# Altium schematic sheet Sheet_1.schdoc
size 298 x 209 mm
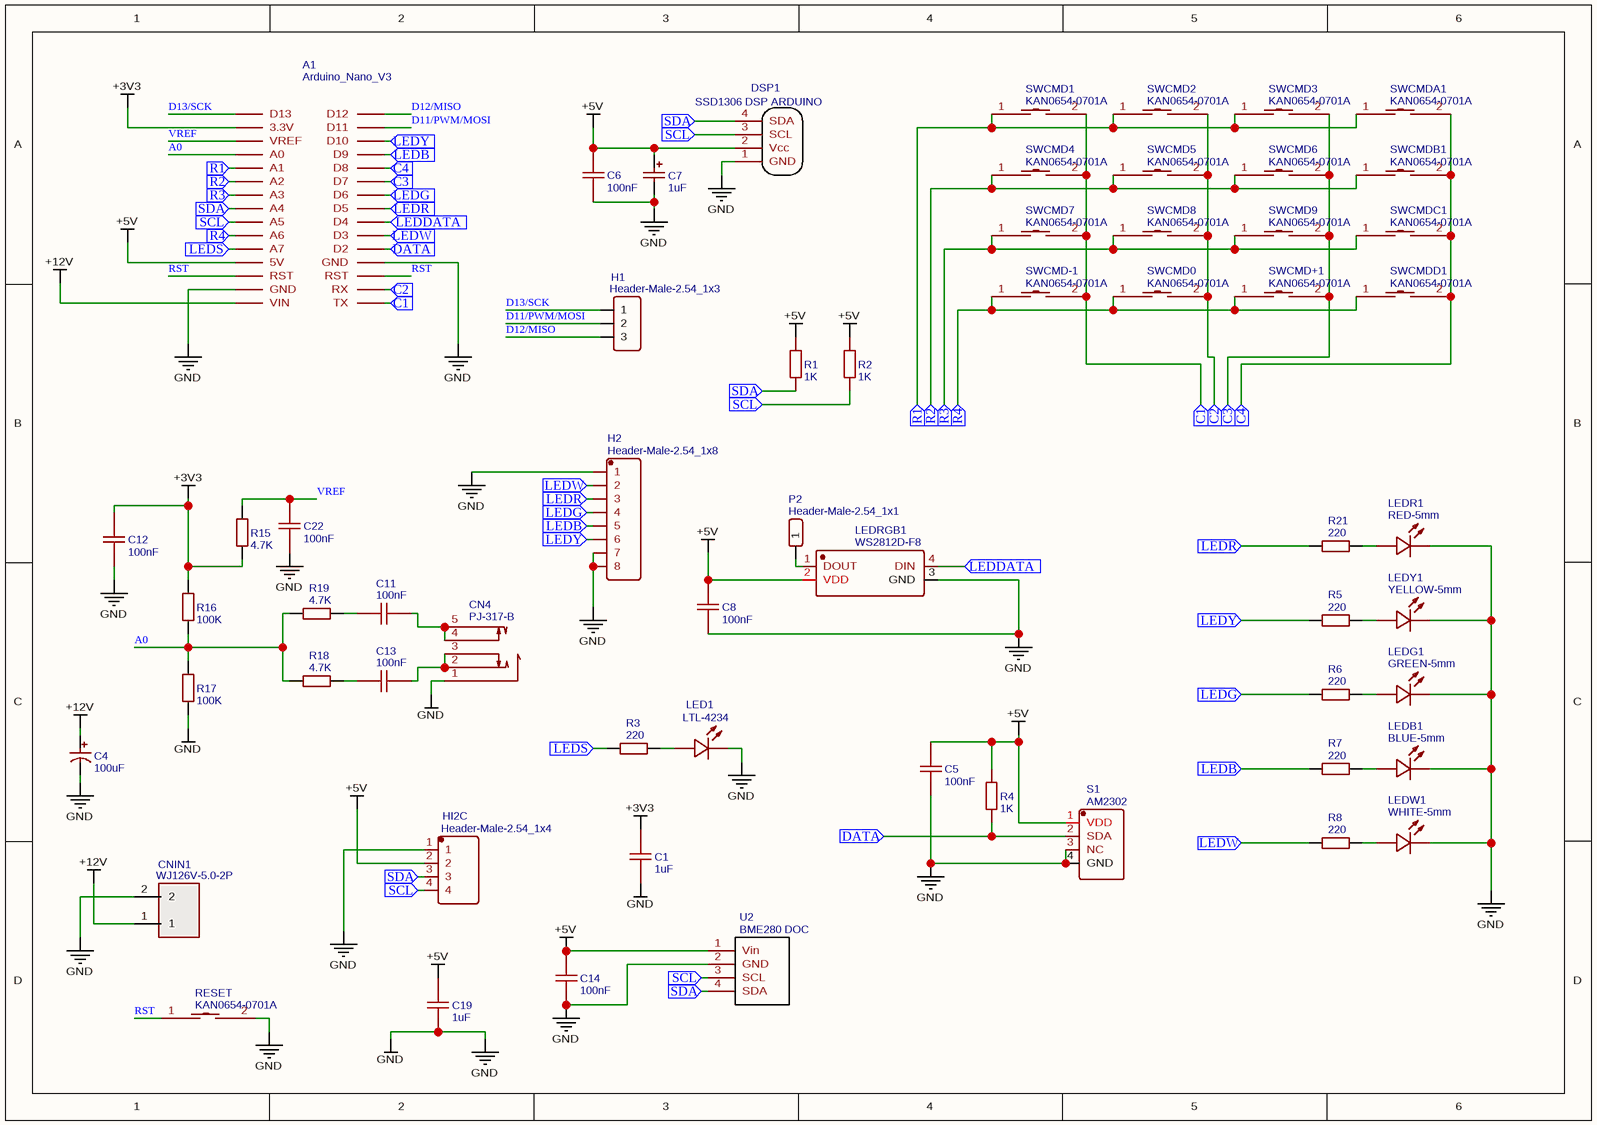
[diagram p0: Sheet_1.schdoc]

## Parts
A1  Arduino_Nano_V3  [ARDUINO_NANO_V3]
C1  1uF  [CAP-CT4-0805-4.2X3.8]
C4  100uF  [CAP-TH_BD6.3-P2.50-D1.0-FD]
C5  100nF  [CAP-CT4-0805-4.2X3.8]
C6  100nF  [CAP-CT4-0805-4.2X3.8]
C7  1uF  [CAP-TAN-S2.5]
C8  100nF  [CAP-CT4-0805-4.2X3.8]
C11  100nF  [CAP-TH_L4.8-W3.2-P5.08-D1.2]
C12  100nF  [CAP-CT4-0805-4.2X3.8]
C13  100nF  [CAP-TH_L4.8-W3.2-P5.08-D1.2]
C14  100nF  [CAP-CT4-0805-4.2X3.8]
C19  1uF  [CAP-CT4-0805-4.2X3.8]
C22  100nF  [CAP-CT4-0805-4.2X3.8]
CN4  PJ-317-B  [AUDIO-SMD_3PIN_PJ-317-B]
CNIN1  WJ126V-5.0-2P  [WJ126V-5.0-2P]
DSP1  SSD1306 DSP ARDUINO  [SSD1306_ARDUINO]
H1  Header-Male-2.54_1x3  [HDR-TH_3P-P2.54-V]
H2  Header-Male-2.54_1x8  [210S-1X8P]
HI2C  Header-Male-2.54_1x4  [DIP-1X4P-2.54MM-M]
LED1  LTL-4234  [LED-TH_BD5.0-P2.54-FD]
LEDB1  BLUE-5mm  [LED-5MM]
LEDG1  GREEN-5mm  [LED-5MM]
LEDR1  RED-5mm  [LED-5MM]
LEDRGB1  WS2812D-F8  [LED-8.0-RGB4P]
LEDW1  WHITE-5mm  [LED-5MM]
LEDY1  YELLOW-5mm  [LED-5MM]
P2  Header-Male-2.54_1x1  [HDR-1X1/2.54]
R1  1K  [AXIAL-0.4]
R2  1K  [AXIAL-0.4]
R3  220  [AXIAL-0.4]
R4  1K  [AXIAL-0.4]
R5  220  [AXIAL-0.4]
R6  220  [AXIAL-0.4]
R7  220  [AXIAL-0.4]
R8  220  [AXIAL-0.4]
R15  4.7K  [AXIAL-0.4]
R16  100K  [AXIAL-0.4]
R17  100K  [AXIAL-0.4]
R18  4.7K  [AXIAL-0.4]
R19  4.7K  [AXIAL-0.4]
R21  220  [AXIAL-0.4]
RESET  KAN0654-0701A  [KAN0654-0601B]
S1  AM2302  [AM2302]
SWCMD0  KAN0654-0701A  [KAN0654-0601B]
SWCMD1  KAN0654-0701A  [KAN0654-0601B]
SWCMD2  KAN0654-0701A  [KAN0654-0601B]
SWCMD3  KAN0654-0701A  [KAN0654-0601B]
SWCMD4  KAN0654-0701A  [KAN0654-0601B]
SWCMD5  KAN0654-0701A  [KAN0654-0601B]
SWCMD6  KAN0654-0701A  [KAN0654-0601B]
SWCMD7  KAN0654-0701A  [KAN0654-0601B]
SWCMD8  KAN0654-0701A  [KAN0654-0601B]
SWCMD9  KAN0654-0701A  [KAN0654-0601B]
SWCMD+1  KAN0654-0701A  [KAN0654-0601B]
SWCMD-1  KAN0654-0701A  [KAN0654-0601B]
SWCMDA1  KAN0654-0701A  [KAN0654-0601B]
SWCMDB1  KAN0654-0701A  [KAN0654-0601B]
SWCMDC1  KAN0654-0701A  [KAN0654-0601B]
SWCMDD1  KAN0654-0701A  [KAN0654-0601B]
U2  BME280 DOC  [BME280 DOC]

## Ports
C1 (in), C2 (in), C3 (in), C4 (in), DATA (in), LEDB (in), LEDDATA (in), LEDG (in), LEDR (in), LEDS (in), LEDW (in), LEDY (in), R1 (in), R2 (in), R3 (in), R4 (in), SCL (in), SDA (in)

## Nets
+3V3: A1.17(3.3V) C1.1 C12.1 R15.1 R16.2
+5V: A1.27(5V) C5.1 C6.1 C7.1 C8.1 C14.1 C19.1 DSP1.2(Vcc) HI2C.2 LEDRGB1.2(VDD) R1.2 R2.2 R4.2 S1.1(VDD) U2.1(Vin)
+12V: A1.30(VIN) C4.1 CNIN1.1
GND: A1.4(GND) A1.29(GND) C1.2 C4.2 C5.2 C6.2 C7.2 C8.2 C12.2 C14.2 C19.2 C22.2 CN4.1 CNIN1.2 DSP1.1(GND) H2.1 H2.7 H2.8 HI2C.1 LED1.2(K) LEDB1.2(K) LEDG1.2(K) LEDR1.2(K) LEDRGB1.3(GND) LEDW1.2(K) LEDY1.2(K) R17.1 RESET.2 S1.3(NC) S1.4(GND) U2.2(GND)
A0: A1.19(A0) R16.1 R17.2 R18.1 R19.1
C1: A1.1(TX) SWCMD1.2 SWCMD4.2 SWCMD7.2 SWCMD-1.2 ; port C1
C2: A1.2(RX) SWCMD0.2 SWCMD2.2 SWCMD5.2 SWCMD8.2 ; port C2
C3: A1.10(D7) SWCMD3.2 SWCMD6.2 SWCMD9.2 SWCMD+1.2 ; port C3
C4: A1.11(D8) SWCMDA1.2 SWCMDB1.2 SWCMDC1.2 SWCMDD1.2 ; port C4
D11/PWM/MOSI: A1.14(D11) H1.2
D12/MISO: A1.15(D12) H1.3
D13/SCK: A1.16(D13) H1.1
DATA: A1.5(D2) R4.1 S1.2(SDA) ; port DATA
LEDB: A1.12(D9) H2.5 R7.1 ; port LEDB
LEDDATA: A1.7(D4) LEDRGB1.4(DIN) ; port LEDDATA
LEDG: A1.9(D6) H2.4 R6.1 ; port LEDG
LEDR: A1.8(D5) H2.3 R21.1 ; port LEDR
LEDS: A1.26(A7) R3.1 ; port LEDS
LEDW: A1.6(D3) H2.2 R8.1 ; port LEDW
LEDY: A1.13(D10) H2.6 R5.1 ; port LEDY
R1: A1.20(A1) SWCMD1.1 SWCMD2.1 SWCMD3.1 SWCMDA1.1 ; port R1
R2: A1.21(A2) SWCMD4.1 SWCMD5.1 SWCMD6.1 SWCMDB1.1 ; port R2
R3: A1.22(A3) SWCMD7.1 SWCMD8.1 SWCMD9.1 SWCMDC1.1 ; port R3
R4: A1.25(A6) SWCMD0.1 SWCMD+1.1 SWCMD-1.1 SWCMDD1.1 ; port R4
RST: A1.3(RST) A1.28(RST) RESET.1
SCL: A1.24(A5) DSP1.3(SCL) HI2C.4 R2.1 U2.3(SCL) ; port SCL
SDA: A1.23(A4) DSP1.4(SDA) HI2C.3 R1.1 U2.4(SDA) ; port SDA
VREF: A1.18(VREF) C22.1 R15.2
NetC11_1: C11.1 R19.2
NetC11_2: C11.2 CN4.4 CN4.5
NetC13_1: C13.1 R18.2
NetC13_2: C13.2 CN4.2 CN4.3
NetLED1_1: LED1.1(A) R3.2
NetLEDB1_1: LEDB1.1(A) R7.2
NetLEDG1_1: LEDG1.1(A) R6.2
NetLEDR1_1: LEDR1.1(A) R21.2
NetLEDRGB1_1: LEDRGB1.1(DOUT) P2.1
NetLEDW1_1: LEDW1.1(A) R8.2
NetLEDY1_1: LEDY1.1(A) R5.2

## Library data of the parts
A1 = Arduino_Nano_V3: BOM_Manufacturer Part: Arduino Nano; Contributor: Coppersillo; spicePre: A
C1 C19 = 1uF: BOM_Manufacturer: FH; BOM_Manufacturer Part: CT4-0805B105K500F1; nameAlias: Capacitance; Contributor: LCSC; BOM_Supplier: LCSC; BOM_Supplier Part: C169113; spicePre: C; spiceSymbolName: CT4-0805B105K500F1
C4 = 100uF: BOM_Manufacturer: ValuePro; BOM_Manufacturer Part: 100uF 50V 6.3*12Black high frequency; nameAlias: Capacitance; BOM_Supplier: LCSC; BOM_Supplier Part: C47891; spicePre: C; spiceSymbolName: 100uF 50V 6.3*12Black high frequency
C5 C6 C8 C12 C14 C22 = 100nF: BOM_Manufacturer: FH; BOM_Manufacturer Part: CT4-0805B104K500F1; nameAlias: Capacitance; Contributor: LCSC; BOM_Supplier: LCSC; BOM_Supplier Part: C168753; spicePre: C; spiceSymbolName: CT4-0805B104K500F1
C7 = 1uF: BOM_Manufacturer: AVX; BOM_Manufacturer Part: TAP105K025SCS; nameAlias: Capacitance; BOM_Supplier: LCSC; BOM_Supplier Part: C49314; spicePre: C; spiceSymbolName: TAP105K025SCS
C11 C13 = 100nF: BOM_Manufacturer: TORCH; BOM_Manufacturer Part: CT4G-0805-2X1-50V-0.1uF-K; nameAlias: Capacitance; Contributor: LCSC; BOM_Supplier: LCSC; BOM_Supplier Part: C141981; spicePre: C; spiceSymbolName: CT4G-0805-2X1-50V-0.1UF-K
CN4 = PJ-317-B: BOM_Manufacturer: XKB Enterprise; Contributor: LCSC; BOM_Supplier: LCSC; BOM_Supplier Part: C381121; BOM_Manufacturer Part: PJ-317-B; spicePre: C
CNIN1 = WJ126V-5.0-2P: BOM_Manufacturer: ReliaPro; BOM_Supplier: LCSC; BOM_Manufacturer Part: WJ126V-5.0-2P; image: //image.lceda.cn/szlcsc/C8404.jpg; BOM_Supplier Part: C8404; spicePre: P; spiceSymbolName: WJ126V-5.0-2P
DSP1 = SSD1306 DSP ARDUINO: nameAlias: Model; Contributor: MatthiasH; spicePre: X; spiceSymbolName: SSD1306 DSP ARDUINO
H1 = Header-Male-2.54_1x3: BOM_Manufacturer: BOOMELE; BOM_Manufacturer Part: Header2.54mm 1*3P; BOM_Supplier: LCSC; image: //image.lceda.cn/szlcsc/C49257.jpg; BOM_Supplier Part: C49257; spicePre: H; spiceSymbolName: Header-Male-2.54_1x3
H2 = Header-Male-2.54_1x8: BOM_Manufacturer: Ckmtw; BOM_Manufacturer Part: 210S-1*8P L=11.6MMGold-plated black; Contributor: LCSC; BOM_Supplier: LCSC; BOM_Supplier Part: C124381; spicePre: H; spiceSymbolName: Header-Male-2.54_1x8
HI2C = Header-Male-2.54_1x4: BOM_Manufacturer: Ckmtw; BOM_Manufacturer Part: 210S-1*4P L=11.6MMGold-plated black; Contributor: LCSC; BOM_Supplier: LCSC; BOM_Supplier Part: C124378; spicePre: H; spiceSymbolName: Header-Male-2.54_1x4
LED1 = LTL-4234: BOM_Manufacturer: LITEON; Contributor: LCSC; BOM_Supplier: LCSC; BOM_Manufacturer Part: LTL-4234; BOM_Supplier Part: C115447; spicePre: L; spiceSymbolName: LTL-4234
LEDB1 = BLUE-5mm: BOM_Manufacturer: KENTO; BOM_Manufacturer Part: 5AR2ST10; BOM_Supplier: LCSC; BOM_Supplier Part: C52721; spicePre: L
LEDG1 = GREEN-5mm: BOM_Manufacturer: KENTO; BOM_Manufacturer Part: 5AR2ST10; BOM_Supplier: LCSC; BOM_Supplier Part: C52721; spicePre: L
LEDR1 = RED-5mm: BOM_Manufacturer: KENTO; BOM_Manufacturer Part: 5AR2ST10; BOM_Supplier: LCSC; BOM_Supplier Part: C52721; spicePre: L
LEDRGB1 = WS2812D-F8: BOM_Manufacturer: Worldsemi; Contributor: LCSC; BOM_Supplier: LCSC; BOM_Manufacturer Part: WS2812D-F8; BOM_Supplier Part: C139126; spicePre: L
LEDW1 = WHITE-5mm: BOM_Manufacturer: KENTO; BOM_Manufacturer Part: 5AR2ST10; BOM_Supplier: LCSC; BOM_Supplier Part: C52721; spicePre: L
LEDY1 = YELLOW-5mm: BOM_Manufacturer: KENTO; BOM_Manufacturer Part: 5AR2ST10; BOM_Supplier: LCSC; BOM_Supplier Part: C52721; spicePre: L
P2 = Header-Male-2.54_1x1: BOM_Manufacturer: ReliaPro; BOM_Supplier: LCSC; BOM_Manufacturer Part: Header-Male-2.54_1x1; BOM_Supplier Part: C81276; spicePre: P
R1 R2 R4 = 1K: BOM_Manufacturer: Chian Chia Elec; nameAlias: Resistance (Ohms); Contributor: LCSC; BOM_Supplier: LCSC; BOM_Supplier Part: C119324; BOM_Manufacturer Part: -; spicePre: R; spiceSymbolName: MF1/4W-1KΩ±1% T52
R3 R5-R8 R21 = 220: BOM_Manufacturer: UniOhm; BOM_Manufacturer Part: MFR0W4F2200A50; nameAlias: Resistance (Ohms); BOM_Supplier: LCSC; BOM_Supplier Part: C57439; spicePre: R; spiceSymbolName: MFR0W4F2200A50
R15 R18 R19 = 4.7K: BOM_Manufacturer: UniOhm; BOM_Manufacturer Part: MFR0W4F4701A50; nameAlias: Resistance (Ohms); BOM_Supplier: LCSC; BOM_Supplier Part: C57204; spicePre: R; spiceSymbolName: MFR0W4F4701A50
R16 R17 = 100K: BOM_Manufacturer: UniOhm; BOM_Manufacturer Part: MFR0W4F1003A50; nameAlias: Resistance (Ohms); BOM_Supplier: LCSC; BOM_Supplier Part: C58597; spicePre: R; spiceSymbolName: MFR0W4F1003A50
RESET SWCMD0-SWCMD9 SWCMD+1 SWCMD-1 SWCMDA1 SWCMDB1 SWCMDC1 SWCMDD1 = KAN0654-0701A: BOM_Manufacturer: GANGYUAN; Contributor: LCSC; BOM_Supplier: LCSC; BOM_Supplier Part: C231710; BOM_Manufacturer Part: KAN0654-0701A; spicePre: S
S1 = AM2302: BOM_Manufacturer: AOSONG; BOM_Supplier: LCSC; BOM_Manufacturer Part: AM2302; BOM_Supplier Part: C83988; spicePre: S
U2 = BME280 DOC: Contributor: Kuba Jaszczur; spicePre: U